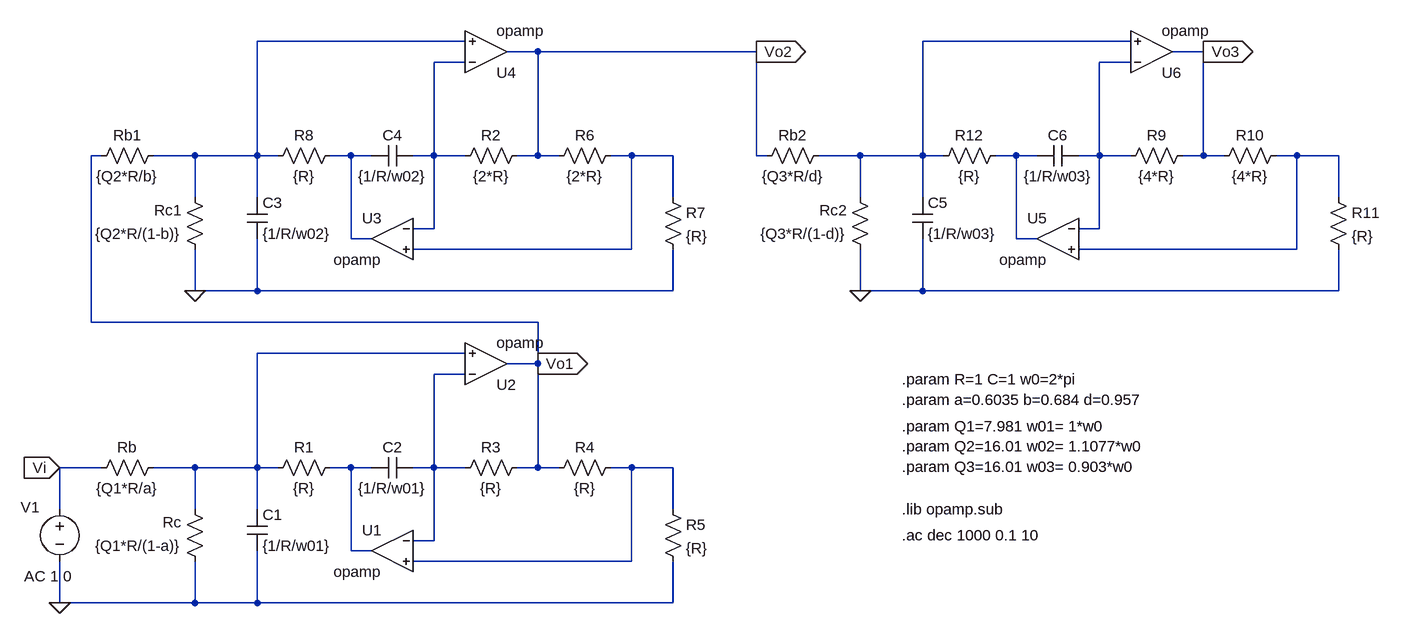
[diagram p0: schematic pasabanda_activo.asc]
pasabanda_activo.asc, the LTspice schematic file:
Version 4
SHEET 1 2028 680
WIRE 608 -560 288 -560
WIRE 1632 -560 1312 -560
WIRE 720 -544 672 -544
WIRE 1056 -544 720 -544
WIRE 1744 -544 1696 -544
WIRE 608 -528 560 -528
WIRE 1632 -528 1584 -528
WIRE 48 -384 32 -384
WIRE 192 -384 128 -384
WIRE 288 -384 288 -560
WIRE 288 -384 192 -384
WIRE 320 -384 288 -384
WIRE 432 -384 400 -384
WIRE 464 -384 432 -384
WIRE 560 -384 560 -528
WIRE 560 -384 528 -384
WIRE 608 -384 560 -384
WIRE 720 -384 720 -544
WIRE 720 -384 688 -384
WIRE 752 -384 720 -384
WIRE 864 -384 832 -384
WIRE 928 -384 864 -384
WIRE 1056 -384 1056 -544
WIRE 1072 -384 1056 -384
WIRE 1216 -384 1152 -384
WIRE 1312 -384 1312 -560
WIRE 1312 -384 1216 -384
WIRE 1344 -384 1312 -384
WIRE 1456 -384 1424 -384
WIRE 1488 -384 1456 -384
WIRE 1584 -384 1584 -528
WIRE 1584 -384 1552 -384
WIRE 1632 -384 1584 -384
WIRE 1744 -384 1744 -544
WIRE 1744 -384 1712 -384
WIRE 1776 -384 1744 -384
WIRE 1888 -384 1856 -384
WIRE 1952 -384 1888 -384
WIRE 192 -320 192 -384
WIRE 288 -320 288 -384
WIRE 928 -320 928 -384
WIRE 1216 -320 1216 -384
WIRE 1312 -320 1312 -384
WIRE 1952 -320 1952 -384
WIRE 560 -272 560 -384
WIRE 560 -272 528 -272
WIRE 1584 -272 1584 -384
WIRE 1584 -272 1552 -272
WIRE 432 -256 432 -384
WIRE 464 -256 432 -256
WIRE 1456 -256 1456 -384
WIRE 1488 -256 1456 -256
WIRE 864 -240 864 -384
WIRE 864 -240 528 -240
WIRE 1888 -240 1888 -384
WIRE 1888 -240 1552 -240
WIRE 192 -176 192 -240
WIRE 288 -176 288 -256
WIRE 288 -176 192 -176
WIRE 928 -176 928 -240
WIRE 928 -176 288 -176
WIRE 1216 -176 1216 -240
WIRE 1312 -176 1312 -256
WIRE 1312 -176 1216 -176
WIRE 1952 -176 1952 -240
WIRE 1952 -176 1312 -176
WIRE 32 -128 32 -384
WIRE 720 -128 32 -128
WIRE 608 -80 288 -80
WIRE 720 -64 720 -128
WIRE 720 -64 672 -64
WIRE 608 -48 560 -48
WIRE 48 96 -16 96
WIRE 192 96 128 96
WIRE 288 96 288 -80
WIRE 288 96 192 96
WIRE 320 96 288 96
WIRE 432 96 400 96
WIRE 464 96 432 96
WIRE 560 96 560 -48
WIRE 560 96 528 96
WIRE 608 96 560 96
WIRE 720 96 720 -64
WIRE 720 96 688 96
WIRE 752 96 720 96
WIRE 864 96 832 96
WIRE 928 96 864 96
WIRE -16 160 -16 96
WIRE 192 160 192 96
WIRE 288 160 288 96
WIRE 928 160 928 96
WIRE 560 208 560 96
WIRE 560 208 528 208
WIRE 432 224 432 96
WIRE 464 224 432 224
WIRE 864 240 864 96
WIRE 864 240 528 240
WIRE -16 304 -16 240
WIRE 192 304 192 240
WIRE 192 304 -16 304
WIRE 288 304 288 224
WIRE 288 304 192 304
WIRE 928 304 928 240
WIRE 928 304 288 304
FLAG -16 304 0
FLAG 192 -176 0
FLAG 1216 -176 0
FLAG 720 -64 Vo1
IOPIN 720 -64 Out
FLAG 1056 -544 Vo2
IOPIN 1056 -544 Out
FLAG 1744 -544 Vo3
IOPIN 1744 -544 Out
FLAG -16 96 Vi
IOPIN -16 96 In
SYMBOL voltage -16 144 R0
WINDOW 0 -60 13 Left 2
WINDOW 3 -55 91 Left 2
WINDOW 123 -55 119 Left 2
WINDOW 39 0 0 Left 0
SYMATTR InstName V1
SYMATTR Value ""
SYMATTR Value2 AC 1 0
SYMBOL res 144 80 R90
WINDOW 0 0 56 VBottom 2
WINDOW 3 32 56 VTop 2
SYMATTR InstName Rb
SYMATTR Value {Q1*R/a}
SYMBOL res 208 256 R180
WINDOW 0 36 76 Left 2
WINDOW 3 36 40 Left 2
SYMATTR InstName Rc
SYMATTR Value {Q1*R/(1-a)}
SYMBOL res 592 112 R270
WINDOW 0 32 56 VTop 2
WINDOW 3 0 56 VBottom 2
SYMATTR InstName R3
SYMATTR Value {R}
SYMBOL res 736 112 R270
WINDOW 0 32 56 VTop 2
WINDOW 3 0 56 VBottom 2
SYMATTR InstName R4
SYMATTR Value {R}
SYMBOL res 912 144 R0
SYMATTR InstName R5
SYMATTR Value {R}
SYMBOL cap 272 160 R0
SYMATTR InstName C1
SYMATTR Value {1/R/w01}
SYMBOL cap 528 80 R90
WINDOW 0 0 32 VBottom 2
WINDOW 3 32 32 VTop 2
SYMATTR InstName C2
SYMATTR Value {1/R/w01}
SYMBOL res 416 80 R90
WINDOW 0 0 56 VBottom 2
WINDOW 3 32 56 VTop 2
SYMATTR InstName R1
SYMATTR Value {R}
SYMBOL OpAmps\\opamp 496 160 M0
SYMATTR InstName U1
SYMBOL OpAmps\\opamp 640 0 M180
SYMATTR InstName U2
SYMBOL res 144 -400 R90
WINDOW 0 0 56 VBottom 2
WINDOW 3 32 56 VTop 2
SYMATTR InstName Rb1
SYMATTR Value {Q2*R/b}
SYMBOL res 208 -224 R180
WINDOW 0 36 76 Left 2
WINDOW 3 36 40 Left 2
SYMATTR InstName Rc1
SYMATTR Value {Q2*R/(1-b)}
SYMBOL res 592 -368 R270
WINDOW 0 32 56 VTop 2
WINDOW 3 0 56 VBottom 2
SYMATTR InstName R2
SYMATTR Value {2*R}
SYMBOL res 736 -368 R270
WINDOW 0 32 56 VTop 2
WINDOW 3 0 56 VBottom 2
SYMATTR InstName R6
SYMATTR Value {2*R}
SYMBOL res 912 -336 R0
SYMATTR InstName R7
SYMATTR Value {R}
SYMBOL cap 272 -320 R0
SYMATTR InstName C3
SYMATTR Value {1/R/w02}
SYMBOL cap 528 -400 R90
WINDOW 0 0 32 VBottom 2
WINDOW 3 32 32 VTop 2
SYMATTR InstName C4
SYMATTR Value {1/R/w02}
SYMBOL res 416 -400 R90
WINDOW 0 0 56 VBottom 2
WINDOW 3 32 56 VTop 2
SYMATTR InstName R8
SYMATTR Value {R}
SYMBOL OpAmps\\opamp 496 -320 M0
SYMATTR InstName U3
SYMBOL OpAmps\\opamp 640 -480 M180
SYMATTR InstName U4
SYMBOL res 1168 -400 R90
WINDOW 0 0 56 VBottom 2
WINDOW 3 32 56 VTop 2
SYMATTR InstName Rb2
SYMATTR Value {Q3*R/d}
SYMBOL res 1232 -224 R180
WINDOW 0 36 76 Left 2
WINDOW 3 36 40 Left 2
SYMATTR InstName Rc2
SYMATTR Value {Q3*R/(1-d)}
SYMBOL res 1616 -368 R270
WINDOW 0 32 56 VTop 2
WINDOW 3 0 56 VBottom 2
SYMATTR InstName R9
SYMATTR Value {4*R}
SYMBOL res 1760 -368 R270
WINDOW 0 32 56 VTop 2
WINDOW 3 0 56 VBottom 2
SYMATTR InstName R10
SYMATTR Value {4*R}
SYMBOL res 1936 -336 R0
SYMATTR InstName R11
SYMATTR Value {R}
SYMBOL cap 1296 -320 R0
SYMATTR InstName C5
SYMATTR Value {1/R/w03}
SYMBOL cap 1552 -400 R90
WINDOW 0 0 32 VBottom 2
WINDOW 3 32 32 VTop 2
SYMATTR InstName C6
SYMATTR Value {1/R/w03}
SYMBOL res 1440 -400 R90
WINDOW 0 0 56 VBottom 2
WINDOW 3 32 56 VTop 2
SYMATTR InstName R12
SYMATTR Value {R}
SYMBOL OpAmps\\opamp 1520 -320 M0
SYMATTR InstName U5
SYMBOL OpAmps\\opamp 1664 -480 M180
SYMATTR InstName U6
TEXT 1280 -40 Left 2 !.param R=1 C=1 w0=2*pi\n.param a=0.6035 b=0.684 d=0.957
TEXT 1280 32 Left 2 !.param Q1=7.981 w01= 1*w0\n.param Q2=16.01 w02= 1.1077*w0\n.param Q3=16.01 w03= 0.903*w0
TEXT 1280 160 Left 2 !.lib opamp.sub
TEXT 1280 200 Left 2 !.ac dec 1000 0.1 10

The netlist it stands for:
* pasabanda_activo.asc
V1 Vi 0 AC 1 0
Rb N009 Vi {Q1*R/a}
Rc 0 N009 {Q1*R/(1-a)}
R3 N010 Vo1 {R}
R4 Vo1 N012 {R}
R5 N012 0 {R}
C1 N009 0 {1/R/w01}
C2 N010 N011 {1/R/w01}
R1 N011 N009 {R}
XU1 N010 N012 N011 opamp Aol=100K GBW=10Meg  ; pins invin noninvin out
XU2 N010 N009 Vo1 opamp Aol=100K GBW=10Meg  ; pins invin noninvin out
Rb1 N001 Vo1 {Q2*R/b}
Rc1 0 N001 {Q2*R/(1-b)}
R2 N003 Vo2 {2*R}
R6 Vo2 N006 {2*R}
R7 N006 0 {R}
C3 N001 0 {1/R/w02}
C4 N003 N005 {1/R/w02}
R8 N005 N001 {R}
XU3 N003 N006 N005 opamp Aol=100K GBW=10Meg  ; pins invin noninvin out
XU4 N003 N001 Vo2 opamp Aol=100K GBW=10Meg  ; pins invin noninvin out
Rb2 N002 Vo2 {Q3*R/d}
Rc2 0 N002 {Q3*R/(1-d)}
R9 N004 Vo3 {4*R}
R10 Vo3 N008 {4*R}
R11 N008 0 {R}
C5 N002 0 {1/R/w03}
C6 N004 N007 {1/R/w03}
R12 N007 N002 {R}
XU5 N004 N008 N007 opamp Aol=100K GBW=10Meg  ; pins invin noninvin out
XU6 N004 N002 Vo3 opamp Aol=100K GBW=10Meg  ; pins invin noninvin out
.param R=1 C=1 w0=2*pi
.param a=0.6035 b=0.684 d=0.957
.param Q1=7.981 w01= 1*w0
.param Q2=16.01 w02= 1.1077*w0
.param Q3=16.01 w03= 0.903*w0
.lib opamp.sub
.ac dec 1000 0.1 10
.backanno
.end